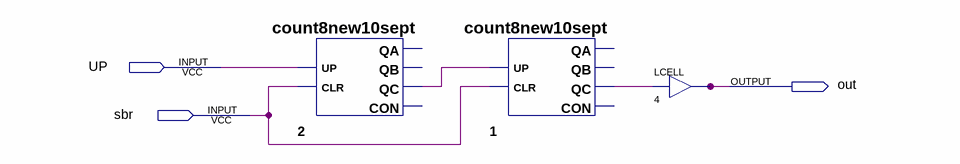
[diagram p0: schematic sheet]
// Quartus schematic count64n.bdf as structural Verilog: 3 symbols, 3 pins
module count64n (
  input  UP,
  input  sbr,
  output out
);

  wire n1_qc, n2_qc;

  count8new10sept u_2 (.UP(UP), .CLR(sbr), .QC(n2_qc));  // open: QA, QB, CON
  count8new10sept u_1 (.UP(n2_qc), .CLR(sbr), .QC(n1_qc));  // open: QA, QB, CON
  LCELL u_4 (.IN(n1_qc), .OUT(out));
endmodule
